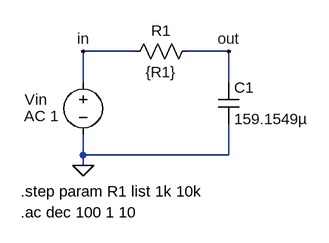
[diagram p0: schematic AC - STEP.asc]
AC - STEP.asc, the LTspice schematic file:
Version 4
SHEET 1 880 680
WIRE 160 96 80 96
WIRE 304 96 240 96
WIRE 80 144 80 96
WIRE 304 144 304 96
WIRE 80 256 80 224
WIRE 304 256 304 208
WIRE 304 256 80 256
WIRE 80 272 80 256
FLAG 80 272 0
FLAG 80 96 in
FLAG 304 96 out
SYMBOL voltage 80 128 R0
WINDOW 3 -215 53 Left 2
WINDOW 123 -91 68 Left 2
WINDOW 39 0 0 Left 0
WINDOW 0 -90 42 Left 2
SYMATTR Value ""
SYMATTR Value2 AC 1
SYMATTR InstName Vin
SYMBOL res 144 112 R270
WINDOW 0 32 56 VTop 2
WINDOW 3 0 56 VBottom 2
SYMATTR InstName R1
SYMATTR Value {R1}
SYMBOL cap 288 144 R0
SYMATTR InstName C1
SYMATTR Value 159.1549µ
TEXT -16 344 Left 2 !.ac dec 100 1 10
TEXT -16 312 Left 2 !.step param R1 list 1k 10k

The netlist it stands for:
* AC - STEP.asc
Vin in 0 AC 1
R1 in out {R1}
C1 out 0 159.1549µ
.ac dec 100 1 10
.step param R1 list 1k 10k
.backanno
.end